# Altium schematic sheet Breakout_v4.SchDoc: Breakoutboard
size A3; CompanyName: Forschungszentrum Jülich GmbH; DrawnBy: D. Hellenbrandt; Organization: IBI-TAE; Address1: Wilhelm-Johnen-Straße; Address2: 52428 Jülich; DocumentNumber: PW8394; Revision: 4; SheetNumber: 1; SheetTotal: 1; ImagePath: C:\Users\d.hellenbrandt\sciebo - Hellenbrandt, Daniel (d.hellenbrandt@fz-juelich.de)@fz-juelich.sciebo.de\Programmdaten\Altium\SharedDocuments\Templates\FZJ.png
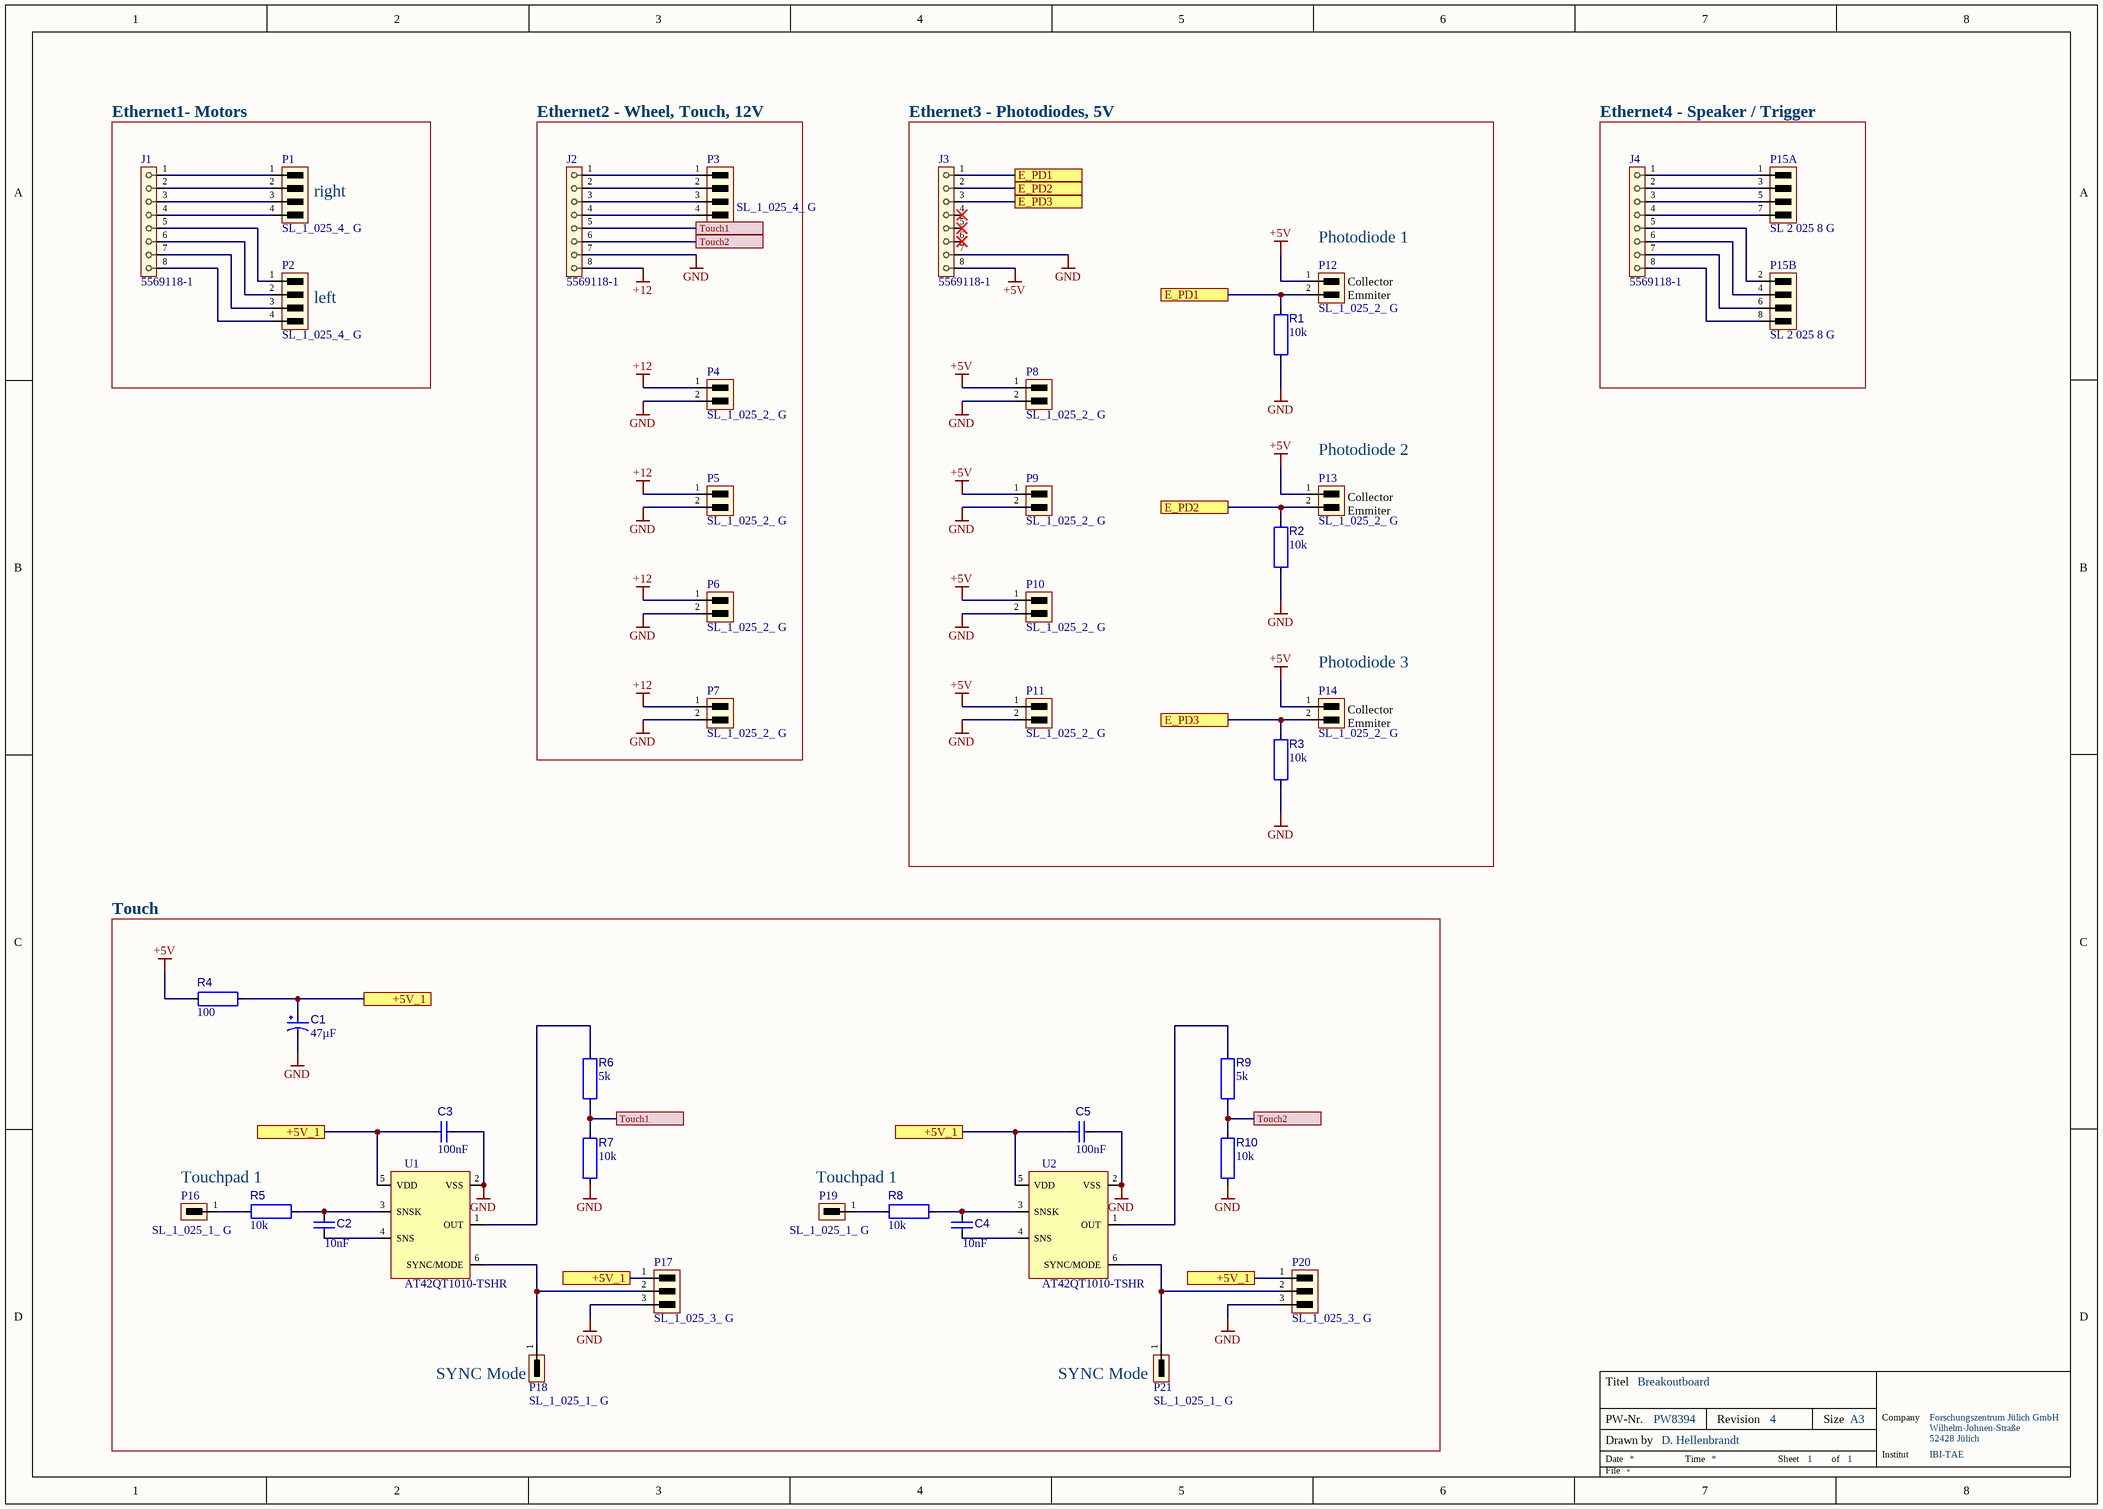
[diagram p0: Breakout_v4.SchDoc]

## Parts
C1  value 47µF  [WCAP-HTAH_D8H11.5]  (hidden comment: 870585774003)
C2  value 10nF  [Copy of 0805]  (hidden comment: 10nF 0805 X7R 50V 5%)
C3  value 100nF  [0805]  (hidden comment: 100nF 0805 X7R 100V)
C4  value 10nF  [Copy of 0805]  (hidden comment: 10nF 0805 X7R 50V 5%)
C5  value 100nF  [0805]  (hidden comment: 100nF 0805 X7R 100V)
J1  5569118-1  [5569118-1-Footprint-1]
J2  5569118-1  [5569118-1-Footprint-1]
J3  5569118-1  [5569118-1-Footprint-1]
J4  5569118-1  [5569118-1-Footprint-1]
P1  SL_1_025_4_ G  [SL_1_025_4_ G]
P2  SL_1_025_4_ G  [SL_1_025_4_ G]
P3  SL_1_025_4_ G  [SL_1_025_4_ G]
P4  SL_1_025_2_ G  [SL_1_025_2_ G]
P5  SL_1_025_2_ G  [SL_1_025_2_ G]
P6  SL_1_025_2_ G  [SL_1_025_2_ G]
P7  SL_1_025_2_ G  [SL_1_025_2_ G]
P8  SL_1_025_2_ G  [SL_1_025_2_ G]
P9  SL_1_025_2_ G  [SL_1_025_2_ G]
P10  SL_1_025_2_ G  [SL_1_025_2_ G]
P11  SL_1_025_2_ G  [SL_1_025_2_ G]
P12  SL_1_025_2_ G  [SL_1_025_2_ G]
P13  SL_1_025_2_ G  [SL_1_025_2_ G]
P14  SL_1_025_2_ G  [SL_1_025_2_ G]
P15  SL 2 025 8 G  [SL 2 025 2 G-Footprint-1]  (parts A,B of 2)
P16  SL_1_025_1_ G  [Copy of SL_1_025_2_ G]
P17  SL_1_025_3_ G  [Copy of SL_1_025_4_ G]
P18  SL_1_025_1_ G  [Copy of SL_1_025_2_ G]
P19  SL_1_025_1_ G  [Copy of SL_1_025_2_ G]
P20  SL_1_025_3_ G  [Copy of SL_1_025_4_ G]
P21  SL_1_025_1_ G  [Copy of SL_1_025_2_ G]
R1  value 10k  [0805 (2012)]  (hidden comment: 10K 0805 200V 0,25W 0,5% 50ppm/K)
R2  value 10k  [0805 (2012)]  (hidden comment: 10K 0805 200V 0,25W 0,5% 50ppm/K)
R3  value 10k  [0805 (2012)]  (hidden comment: 10K 0805 200V 0,25W 0,5% 50ppm/K)
R4  value 100  [1206 (3216)]  (hidden comment: 100R 1206 200V 0,25W 25ppm/K)
R5  value 10k  [0805 (2012)]  (hidden comment: 10K 0805 200V 0,25W 0,5% 50ppm/K)
R6  value 5k  [0805 (2012)]  (hidden comment: 5K 0805 100V 0,2W)
R7  value 10k  [0805 (2012)]  (hidden comment: 10K 0805 200V 0,25W 0,5% 50ppm/K)
R8  value 10k  [0805 (2012)]  (hidden comment: 10K 0805 200V 0,25W 0,5% 50ppm/K)
R9  value 5k  [0805 (2012)]  (hidden comment: 5K 0805 100V 0,2W)
R10  value 10k  [0805 (2012)]  (hidden comment: 10K 0805 200V 0,25W 0,5% 50ppm/K)
U1  AT42QT1010-TSHR  [6ST1_M]
U2  AT42QT1010-TSHR  [6ST1_M]

## Blocks framed on the sheet
Ethernet2 - Wheel, Touch, 12V: J2 P3-P7
Ethernet4 - Speaker / Trigger: J4 P15

## Ports
+5V_1 (see Breakout_v4[1D], Breakout_v4[2C], Breakout_v4[3D], Breakout_v4[4D]), +5V_1 (see Breakout_v4[1D], Breakout_v4[2C], Breakout_v4[3D], Breakout_v4[5D]), +5V_1 (see Breakout_v4[1D], Breakout_v4[2C], Breakout_v4[4D], Breakout_v4[5D]), +5V_1 (see Breakout_v4[1D], Breakout_v4[3D], Breakout_v4[4D], Breakout_v4[5D]), +5V_1 (see Breakout_v4[2C], Breakout_v4[3D], Breakout_v4[4D], Breakout_v4[5D]), E_PD1 (see Breakout_v4[4A]), E_PD1 (see Breakout_v4[5A]), E_PD2 (see Breakout_v4[4A]), E_PD2 (see Breakout_v4[5B]), E_PD3 (see Breakout_v4[4A]), E_PD3 (see Breakout_v4[5B]), Touch1 (see Breakout_v4[3A]), Touch1 (see Breakout_v4[3C]), Touch2 (see Breakout_v4[3A]), Touch2 (see Breakout_v4[5C])

## Nets
+5V: J3.8 P8.1 P9.1 P10.1 P11.1 P12.1 P13.1 P14.1 R4.2
+12: J2.8 P4.1 P5.1 P6.1 P7.1
GND: C1.2 C3.2 C5.2 J2.7 J3.7 P4.2 P5.2 P6.2 P7.2 P8.2 P9.2 P10.2 P11.2 P17.3 P20.3 R1.1 R2.1 R3.1 R7.1 R10.1 U1.2(VSS) U2.2(VSS)
+5V_1: C1.1 C3.1 C5.1 P17.1 P20.1 R4.1 U1.5(VDD) U2.5(VDD) ; port +5V_1
E_PD1: J3.1 P12.2 R1.2 ; port E_PD1
E_PD2: J3.2 P13.2 R2.2 ; port E_PD2
E_PD3: J3.3 P14.2 R3.2 ; port E_PD3
Touch1: J2.5 R6.1 R7.2 ; port Touch1
Touch2: J2.6 R9.1 R10.2 ; port Touch2
NetC2_1: C2.1 U1.4(SNS)
NetC2_2: C2.2 R5.2 U1.3(SNSK)
NetC4_1: C4.1 U2.4(SNS)
NetC4_2: C4.2 R8.2 U2.3(SNSK)
NetJ1_1: J1.1 P1.1
NetJ1_2: J1.2 P1.2
NetJ1_3: J1.3 P1.3
NetJ1_4: J1.4 P1.4
NetJ1_5: J1.5 P2.1
NetJ1_6: J1.6 P2.2
NetJ1_7: J1.7 P2.3
NetJ1_8: J1.8 P2.4
NetJ2_1: J2.1 P3.1
NetJ2_2: J2.2 P3.2
NetJ2_3: J2.3 P3.3
NetJ2_4: J2.4 P3.4
NetJ4_1: J4.1 P15.1
NetJ4_2: J4.2 P15.3
NetJ4_3: J4.3 P15.5
NetJ4_4: J4.4 P15.7
NetJ4_5: J4.5 P15.2
NetJ4_6: J4.6 P15.4
NetJ4_7: J4.7 P15.6
NetJ4_8: J4.8 P15.8
NetP16_1: P16.1 R5.1
NetP17_2: P17.2 P18.1 U1.6(SYNC/MODE)
NetP19_1: P19.1 R8.1
NetP20_2: P20.2 P21.1 U2.6(SYNC/MODE)
NetR6_2: R6.2 U1.1(OUT)
NetR9_2: R9.2 U2.1(OUT)

Not connected (* = marked no-connect by the designer): J3 4* 5* 6*

## Notes on the sheet
- Ethernet1- Motors
- (near J3) Ethernet3 - Photodiodes, 5V
- (near P1) right
- (near P12) Photodiode 1
- (near P2) left
- (near P12) Collector
  Emmiter
- (near P13) Photodiode 2
- (near P13) Collector
  Emmiter
- (near P14) Photodiode 3
- (near P14) Collector
  Emmiter
- Touch
- Touchpad 1
- (near P18) SYNC Mode
- (near P21) SYNC Mode
- Titel
- PW-Nr.
- Date
- Drawn by
- Time
- Revision
- Sheet
- Size
- of
- A3
- Institut
- Company
- File

## Library data of the parts
C1 = CMP-001-00097-1: Cap, 47Uf, 50V, Alu Elec, Hybrid, Rad Rohs Compliant: Yes; Manufacturer: Würth Elektronik; user: IBI-TAE; Capacitor Type: Aluminum Hybrid; ESR: 0,03Ohm; Tolerance: 20%; Min Operating Temperature: -55°C; Max Operating Temperature: 125°C; Mounting Technology: THT; Pins: 2; Voltage Rating: 50V; RoHS Compliant: Yes
C2 C4 = CMP-001-00096-1: Kondensator 10nF 0805 X7R 50V 5%; user: IBI-TAE; Capacitor Type: Ceramic; Mounting Technology: Surface Mount; Case/Package: 0805; Max Operating Temperature: 150°C; Min Operating Temperature: -55°C; RoHS Compliant: Yes; Pins: 2
C3 C5 = CMP-001-00095-1: Kondensator 100nF 0805 X7R 100V 5%; Capacitor Type: Ceramic; user: IBI-TAE; Case/Package: 0805; Max Operating Temperature: 125°C; Voltage Rating: 100V; Min Operating Temperature: -55°C; Mounting Technology: Surface Mount; Tolerance: 5%; Pins: 2; RoHS Compliant: Yes
J1-J4 = CMP-002-00096-6: Telecom and Datacom Connector, 8 Contact(s), Female, Right Angle, Solder Terminal, Locking, Jack; User: IBI-TAE; Min Operating Temperature: -40°C; Pins: 8; Mounting Technology: Panel,Board; Max Operating Temperature: 85°C; RoHS Compliant: Yes; Case/Package: RJ45; Connector Type: TELECOM AND DATACOM CONNECTOR
P1-P3 = CMP-002-00109-2: Fischer SL_1_025_4_ G, Stiftleiste, 1 Reiheb, 4 Pole, vergoldet; Connector Type: BOARD CONNECTOR; Max Current Rating: 3A; Voltage Rating: 300V; Number of Rows Loaded: 1; Gender: male; Number of Contacts: 4; user: IBI-TAE; Terminal Pitch: 2.54mm; Contact Finish - Mating: GOLD; Mounting Style: STRAIGHT; Mounting Technology: Board; Contact Finish - Termination: GOLD; Contact Gender: Male; Pins: 4; RoHS Compliant: Yes
P4-P14 = CMP-002-00108-2: Fischer SL_1_025_2_ G, Stiftleiste, 1 Reiheb, 2 Pole, vergoldet; Gender: male; user: IBI-TAE; Voltage Rating: 300V; Connector Type: BOARD CONNECTOR; Number of Contacts: 2; Number of Rows Loaded: 1; Max Current Rating: 3A; RoHS Compliant: Yes; Pins: 2; Contact Finish - Termination: GOLD; Terminal Pitch: 2.54mm; Contact Gender: Male; Mounting Style: STRAIGHT; Contact Finish - Mating: GOLD; Mounting Technology: Board
P15 = CMP-002-00101-2: Fischer  SL 2 025 8 G, Stiftleiste, 2 Reiheb, 8 Pole, vergoldet; Number of Contacts: 8; Max Current Rating: 3A; Connector Type: BOARD CONNECTOR; Gender: male; Number of Rows Loaded: 2; Voltage Rating: 300V; user: IBI-TAE; Pins: 6; Mounting Technology: Board; Terminal Pitch: 2.54mm; RoHS Compliant: Yes; Contact Finish - Mating: GOLD; Contact Finish - Termination: GOLD; Mounting Style: STRAIGHT; Contact Gender: Male
P16 P18 P19 P21 = CMP-002-00110-1: Fischer SL_1_025_1_ G, Stiftleiste, 1 Reiheb, 1 Pole, vergoldet; Max Current Rating: 3A; Voltage Rating: 300V; Number of Rows Loaded: 1; user: IBI-TAE; Gender: male; Connector Type: BOARD CONNECTOR; RoHS Compliant: Yes; Mounting Technology: Board; Contact Finish - Termination: GOLD; Pins: 1; Number of Contacts: 1; Contact Gender: Male; Terminal Pitch: 2.54mm; Mounting Style: STRAIGHT; Contact Finish - Mating: GOLD
P17 P20 = CMP-002-00111-1: Fischer SL_1_025_3_ G, Stiftleiste, 1 Reiheb, 3 Pole, vergoldet; Gender: male; Voltage Rating: 300V; Connector Type: BOARD CONNECTOR; Number of Contacts: 3; Max Current Rating: 3A; Number of Rows Loaded: 1; user: IBI-TAE; Pins: 3; Terminal Pitch: 2.54mm; RoHS Compliant: Yes; Mounting Style: STRAIGHT; Contact Gender: Male; Contact Finish - Mating: GOLD; Mounting Technology: Board; Contact Finish - Termination: GOLD
R1-R3 R5 R7 R8 R10 = CMP-009-00206-1: Widerstand 10K 0805 200V 0,25W 0,5% 50ppm/K; Power: 250mW; Tolerance: 0.5%; user: IBI-TAE; Min Operating Temperature: -55°C; Max Operating Temperature: 155°C; Voltage Rating: 200V; RoHS Compliant: Yes; Temperaturkoeffizient: 50 ppm/K; Mounting Technology: Surface Mount; Pins: 2; Case/Package: 0805
R4 = CMP-009-00204-1: Widerstans SMD 100R 1206 200V 0,25W 25ppm/K; Power: 250mW; user: IBI-TAE; Tolerance: 1%; Min Operating Temperature: -55°C; Mounting Technology: SMD; Voltage Rating: 200V; Max Operating Temperature: 155°C; Pins: 2; Case/Package: 1206
R6 R9 = CMP-009-00208-1: Widerstand 5K 0805 100V 0,2W 25ppm/K; user: IBI-TAE; Power: 200mW; Tolerance: 0.1%; Min Operating Temperature: -55°C; Voltage Rating: 100V; Mounting Technology: Surface Mount; RoHS Compliant: yes; Case/Package: 0805; Max Operating Temperature: 150°C; Pins: 2
U1 U2 = CMP-031-00017-3: Analog Circuit, 1 Func, PDSO6 ; Touchsensor; digital burst mode charge-transfer sensor ;; Max Supply Voltage: 5.5V; Channels: 1; Min Supply Voltage: 1.8V; User: IBI-TAE; Nominal Supply Voltage: 3V; Time @ Peak Reflow Temperature-Max (s): 40s; Qualification Status: Not Qualified; Package Body Material: Plastic; RoHS Compliant: Yes; Throw Configuration: ANALOG CIRCUIT; Package Shape: Rectangular; Reach SVHC Compliant: Yes; Surface Mount: Yes; Terminal Pitch: 0.95mm; Height - Seated (Max): 1.45mm; Temperature Grade: INDUSTRIAL; Max Operating Temperature: 85°C; Peak Reflow Temperature (Cel): 260°C; Moisture Sensitivity Level: 1; Case/Package: LSSOP; JESD-609 Code: e4; Length: 2.9mm; Min Operating Temperature: -40°C; Terminal Finish: Nickel; JESD-30 Code: R-PDSO-G6; Width: 1.6mm; Package Style: SMALL OUTLINE, LOW PROFILE, SHRINK PITCHMeter; Pins: 6; Terminal Form: Gull Wing; Terminal Position: DUAL